# Altium project rovables_motor_driver_v3.PrjPcb
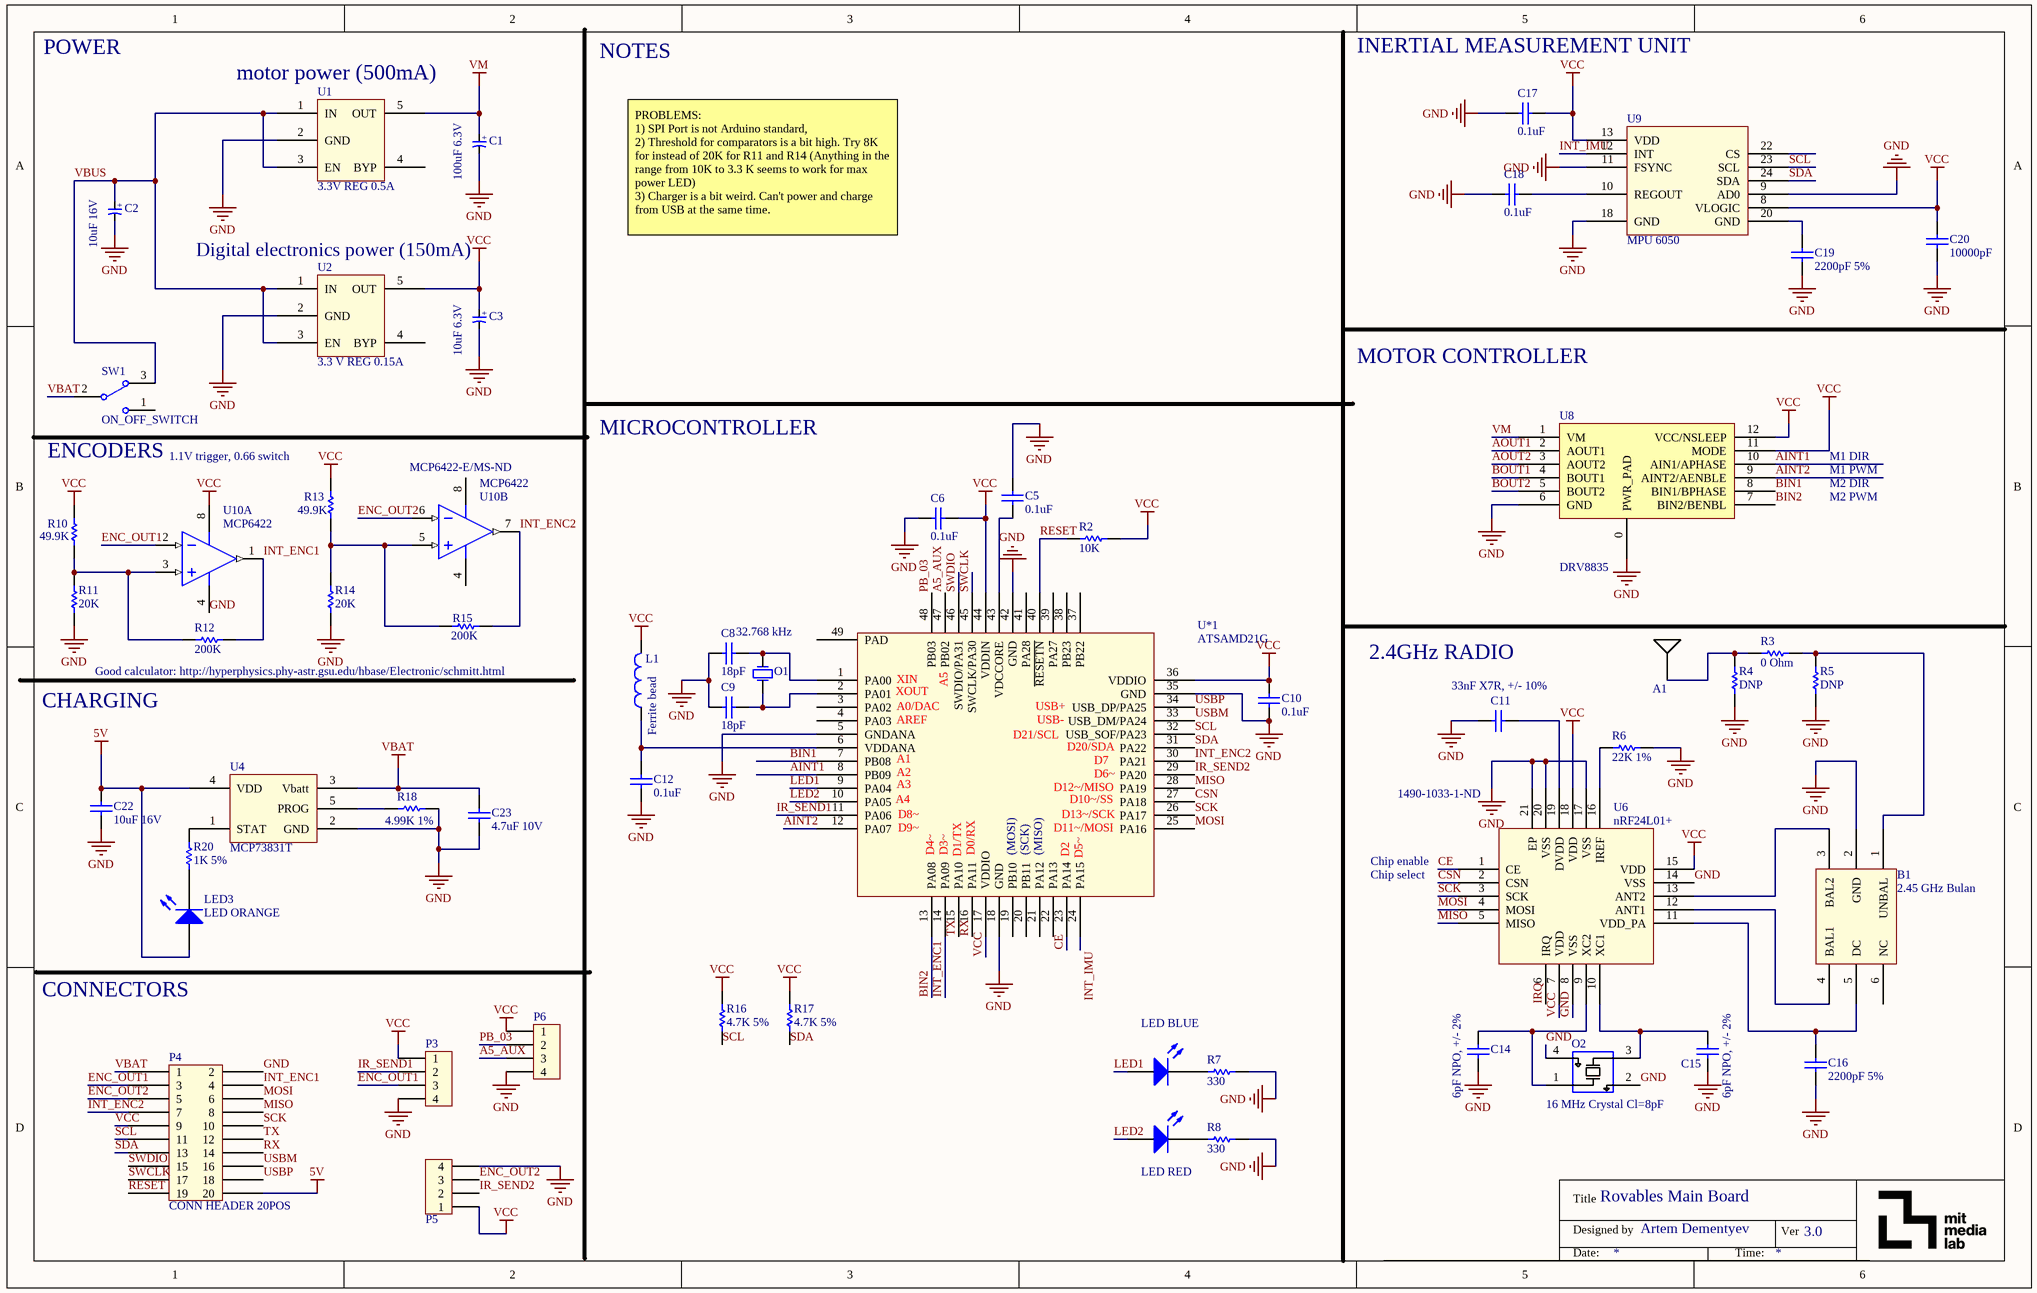
[diagram p0: schematic_motor_driver_v3.SchDoc]
1 sheet, 57 parts. Net scope: global (net labels, ports and power ports of the same name join across sheets).
Board file: PCB_motor_driver_v3.PcbDoc

## Sheet schematic_motor_driver_v3.SchDoc: Rovables Main Board
size B; Author: Artem Dementyev; Revision: 3.0; SheetNumber: 1; SheetTotal: 1

### Parts
A1  2.4GHz SMT On-ground MID Chip Antenna  [47948-0001]  (value not drawn)
B1  2.45 GHz Bulan  [2450BM14A0002]
C1  100uF 6.3V  [CAP1206]
C2  10uF 16V  [CAP0805]
C3  10uF 6.3V  [0805 TANTALUM]
C5  0.1uF  [0603W]
C6  0.1uF  [0402 CAPACITOR]
C8  18pF  [0402 CAPACITOR]
C9  18pF  [0402 CAPACITOR]
C10  0.1uF  [0402 CAPACITOR]
C11  33nF X7R, +/- 10%  [0402 CAPACITOR]
C12  0.1uF  [0603W]
C14  6pF NPO, +/- 2%  [0402 CAPACITOR]
C15  6pF NPO, +/- 2%  [0402 CAPACITOR]
C16  2200pF 5%  [0402 CAPACITOR]
C17  0.1uF  [0402 CAPACITOR]
C18  0.1uF  [0402 CAPACITOR]
C19  2200pF 5%  [0402 CAPACITOR]
C20  10000pF  [0402 CAPACITOR]
C22  10uF 16V  [0603W]
C23  4.7uF 10V  [0603W]
L1  Ferrite bead  [0603W]
LED1  LED BLUE  [0402W]
LED2  LED RED  [0402W]
LED3  LED ORANGE  [0402W]
O1  32.768 kHz  [32.768 Crystal]
O2  16 MHz Crystal Cl=8pF  [2.5 x 2.0 crystal]
P3  FH33J-4S-0.5SH(99)  [FH33J-4S-0.5SH(99)]  (value not drawn)
P4  CONN HEADER 20POS  [DF12 20 POS]
P5  FH33J-4S-0.5SH(99)  [FH33J-4S-0.5SH(99)]  (value not drawn)
P6  FH33J-4S-0.5SH(99)  [FH33J-4S-0.5SH(99)]  (value not drawn)
R2  10K  [0402 RESISTOR]
R3  0 Ohm  [0402 RESISTOR]
R4  DNP  [0402 RESISTOR]
R5  DNP  [0402 RESISTOR]
R6  22K 1%  [0402 RESISTOR]
R7  330  [0402 RESISTOR]
R8  330  [0402 RESISTOR]
R10  49.9K  [0603W]
R11  20K  [0603W]
R12  200K  [0603W]
R13  49.9K  [0603W]
R14  20K  [0603W]
R15  200K  [0603W]
R16  4.7K 5%  [0402 RESISTOR]
R17  4.7K 5%  [0402 RESISTOR]
R18  4.99K 1%  [0603W]
R20  1K 5%  [0603W]
SW1  ON_OFF_SWITCH  [SWTICH_SMD_SIDE]
U1  3.3V REG 0.5A  [SOT-23-5]
U2  3.3 V REG 0.15A  [SOT-23-5]
U4  MCP73831T  [SOT-23-5]
U6  nRF24L01+  Supplier Part Number 1: 1490-1033-1-ND  [QFN20]
U8  DRV8835  [WSON-16]
U9  MPU 6050  [QFN24]
U10  MCP6422  [MSOP-MS8_N]  (parts A,B of 2)
U*1  ATSAMD21G  [TQFN48]

### Nets
5V: C22.1 LED3.1(A) P4.20 U4.4(VDD)
GND: B1.2(GND) C1.2 C2.2 C3.2 C5.2 C6.2 C8.2 C9.2 C10.1 C11.2 C12.1 C14.1 C15.1 C16.1 C17.2 C18.2 C19.2 C20.2 C22.2 C23.2 O2.2(Gnd) O2.4(Gnd) P3.4 P4.2 P5.4 P6.4 R4.1 R5.1 R6.1 R7.1 R8.1 R11.1 R14.1 R18.1 U1.2(GND) U2.2(GND) U4.2(GND) U6.8(VSS) U6.14(VSS) U6.17(VSS) U6.20(VSS) U6.21(EP) U8.0(PWR_PAD) U8.6(GND) U9.9(AD0) U9.11(FSYNC) U9.18(GND) U10.4(VSS) U*1.5(GNDANA) U*1.18(GND) U*1.35(GND) U*1.42(GND)
VBAT: C23.1 P4.1 SW1.2 U4.3(Vbatt)
VCC: C3.1 C6.1 C10.2 C17.1 C20.1 L1.2 P3.1 P4.9 P5.1 P6.1 R2.1 R10.2 R13.2 R16.1 R17.1 U2.5(OUT) U6.7(VDD) U6.15(VDD) U6.18(VDD) U8.11(MODE) U8.12(VCC/NSLEEP) U9.8(VLOGIC) U9.13(VDD) U10.8(VDD) U*1.17(VDDIO) U*1.36(VDDIO) U*1.44(VDDIN)
VM: C1.1 U1.5(OUT) U8.1(VM)
A5_AUX: P6.3 U*1.47(PB02)
AINT1: U8.10(AIN1/APHASE) U*1.8(PB09)
AINT2: U8.9(AINT2/AENBLE) U*1.12(PA07)
AOUT1: U8.2(AOUT1)
AOUT2: U8.3(AOUT2)
BIN1: U8.8(BIN1/BPHASE) U*1.7(PB08)
BIN2: U8.7(BIN2/BENBL) U*1.13(PA08)
BOUT1: U8.4(BOUT1)
BOUT2: U8.5(BOUT2)
CE: U6.1(CE) U*1.23(PA14)
CSN: U6.2(CSN) U*1.27(PA18)
ENC_OUT1: P3.3 P4.3 U10.2(VINA-)
ENC_OUT2: P4.5 P5.3 U10.6(VINB-)
INT_ENC1: P4.4 R12.1 U10.1(VOUTA) U*1.14(PA09)
INT_ENC2: P4.7 R15.1 U10.7(VOUTB) U*1.30(PA21)
INT_IMU: U9.12(INT) U*1.24(PA15)
IR_SEND1: P3.2 U*1.11(PA06)
IR_SEND2: P5.2 U*1.29(PA20)
IRQ: U6.6(IRQ)
LED1: LED1.1(A) U*1.9(PA04)
LED2: LED2.1(A) U*1.10(PA05)
MISO: P4.8 U6.5(MISO) U*1.28(PA19)
MOSI: P4.6 U6.4(MOSI) U*1.25(PA16)
PB_03: P6.2 U*1.48(PB03)
RESET: P4.19 R2.2 U*1.40(~{RESETN})
RX: P4.14 U*1.16(PA11)
SCK: P4.10 U6.3(SCK) U*1.26(PA17)
SCL: P4.11 R16.2 U9.23(SCL) U*1.32(USB_SOF/PA23)
SDA: P4.13 R17.2 U9.24(SDA) U*1.31(PA22)
SWCLK: P4.17 U*1.45(SWCLK/PA30)
SWDIO: P4.15 U*1.46(SWDIO/PA31)
TX: P4.12 U*1.15(PA10)
USBM: P4.16 U*1.33(USB_DM/PA24)
USBP: P4.18 U*1.34(USB_DP/PA25)
VBUS: C2.1 SW1.3 U1.1(IN) U1.3(EN) U2.1(IN) U2.3(EN)
NetA1_1: A1.1 R3.1 R4.2
NetB1_1: B1.1(UNBAL) R3.2 R5.2
NetB1_3: B1.3(BAL2) U6.13(ANT2)
NetB1_4: B1.4(BAL1) U6.12(ANT1)
NetB1_5: B1.5(DC) C16.2 U6.11(VDD_PA)
NetC5_1: C5.1 U*1.43(VDCCORE)
NetC8_1: C8.1 O1.1 U*1.1(PA00)
NetC9_1: C9.1 O1.2 U*1.2(PA01)
NetC11_1: C11.1 U6.19(DVDD)
NetC12_2: C12.2 L1.1 U*1.6(VDDANA)
NetC14_2: C14.2 O2.1(XIN) U6.9(XC2)
NetC15_2: C15.2 O2.3(XOUT) U6.10(XC1)
NetC18_1: C18.1 U9.10(REGOUT)
NetC19_1: C19.1 U9.20(GND)
NetLED1_2: LED1.2(K) R7.2
NetLED2_2: LED2.2(K) R8.2
NetLED3_2: LED3.2(K) R20.1
NetR6_2: R6.2 U6.16(IREF)
NetR10_1: R10.1 R11.2 R12.2 U10.3(VINA+)
NetR13_1: R13.1 R14.2 R15.2 U10.5(VINB+)
NetR18_2: R18.2 U4.5(PROG)
NetR20_2: R20.2 U4.1(STAT)

Not connected (* = marked no-connect by the designer): B1 6(NC); SW1 1; U1 4(BYP); U2 4(BYP); U9 22(CS); U*1 3(PA02) 4(PA03) 19(PB10) 20(PB11) 21(PA12) 22(PA13) 37(PB22) 38(PB23) 39(PA27) 41(PA28) 49(PAD)

### Notes on the sheet
- POWER
- (near U1) motor power (500mA)
- NOTES
- INERTIAL MEASUREMENT UNIT
- PROBLEMS:
  1) SPI Port is not Arduino standard,
  2) Threshold for comparators is a bit high. Try 8K for instead of 20K for R11 and R14 (Anything in the range from 10K to 3.3 K seems to work for max power LED)
  3) Charger is a bit weird. Can't power and charge from USB at the same time.
- (near U2) Digital electronics power (150mA)
- MOTOR CONTROLLER
- MICROCONTROLLER
- (near SW1) ENCODERS
- (near R13) 1.1V trigger, 0.66 switch
- M2 PWM
- M2 DIR
- M1 PWM
- M1 DIR
- Good calculator: http://hyperphysics.phy-astr.gsu.edu/hbase/Electronic/schmitt.html
- 2.4GHz RADIO
- CHARGING
- (near U*1) (MOSI)
- (near U*1) (SCK)
- (near U*1) (MISO)
- Chip enable
- Chip select
- CONNECTORS
- Title
- Designed by
- Ver
- Date:
- Time:
- (in symbol ATSAMD21G) XIN; A5; XOUT; A0/DAC; USB+; AREF; USB-; D21/SCL; D20/SDA; A1; D7; A2; D6~; A3; D12~/MISO; A4; D10~/SS; D8~; D13~/SCK; D9~; D11~/MOSI; D4~; D3~; D1/TX; D0/RX; D2; D5~
- (in symbol Capacitor_pol) +

### Library data of the parts
A1 = 2.4GHz SMT On-ground MID Chip Antenna: Bluetooth antenna; manufacturer: Molex; digikey part number: WM4893CT-ND; manufacturer part number: 47948-0001; Supplier 1: Digi-Key; Supplier Part Number 1: WM4893CT-ND
B1 = 2.45 GHz Bulan: for nRF8001 chip; digikey number: 712-1574-1-ND; Supplier 1: Digi-Key; Supplier Part Number 1: 712-1574-1-ND
C1-C3 = Capacitor_pol: Polarised capacitor
  C1: digikey part number 1206: 718-1920-1-ND; digikey part numbe 0805: 478-6613-2-ND; Supplier 1: Digikey; Supplier Part Number 1: 718-1920-1-ND
  C2: digikey part number: 478-8654-1-ND; Supplier 1: Digi-Key; Supplier Part Number 1: 478-8654-1-ND
  C3: digikey part number: 478-9265-1-ND; Supplier 1: Digi-Key; Supplier Part Number 1: 478-9265-1-ND
C5 C6 C8-C12 C14-C20 C22 C23 = Capacitor: SMD Cap 1206
  C5: Supplier 1: Digikey; Supplier Part Number 1: 311-1343-1-ND
  C6 C10: Supplier 1: Digikey; Supplier Part Number 1: 1276-1443-6-ND
  C8 C9: Supplier 1: Digikey; Supplier Part Number 1: 490-5858-1-ND
  C11: digikey number: 490-1532-1-ND; Supplier 1: Digikey; Supplier Part Number 1: 399-4891-1-ND
  C14 C15: digikey number: 490-8223-1-ND; Supplier 1: Digikey; Supplier Part Number 1: 490-8223-6-ND
  C16: digikey number: 399-8957-1-ND; Supplier 1: Digikey; Supplier Part Number 1: 399-8957-1-ND
  C17 C18: digikey number: 587-3383-1-ND; Supplier 1: Digikey; Supplier Part Number 1: 1276-1443-6-ND
  C19: digikey number: 587-3383-1-ND; Supplier 1: Digikey; Supplier Part Number 1: 399-8957-1-ND
  C20: digikey number: 587-3383-1-ND; Supplier 1: Digikey; Supplier Part Number 1: 490-4516-1-ND
  C22: Supplier 1: Digikey; Supplier Part Number 1: 490-3298-1-ND; Supplier 2: Mouser; Supplier Part Number 2: 81-GRM188C81C106MA3D
  C23: Supplier 1: Digikey; Supplier Part Number 1: 490-10477-1-ND
L1 = INDUCTOR Low DCR: Digikey: 490-5223-2-ND; Supplier 1: Digikey; Supplier Part Number 1: 490-5223-2-ND
LED1-LED3 = LED: LED SMD 1206/0603; Supplier 1: Digikey
  LED1: Supplier Part Number 1: LNJ947W8CRACT-ND
  LED2: Supplier Part Number 1: LNJ247W82RACT-ND
  LED3: Supplier Part Number 1: LNJ437W84RACT-ND
O1 = 32.768 Crystal: digikey number: XC1617CT-ND; Supplier 1: Digi-Key; Supplier Part Number 1: XC1617CT-ND
O2 = 16 MHz Crystal Wireless: For BLE use; digikey number: 644-1169-1-ND; Supplier 1: Digi-Key; Supplier Part Number 1: 644-1169-1-ND
P3 P5 P6 = FH33J-4S-0.5SH(99): 0.5mm FPC connector; digikey part number: H124646CT-ND; Supplier 1: Digi-Key; Supplier Part Number 1: H124646CT-ND
P4 = CONN HEADER 20POS: manufacturer part number: DF12D(4.0)-20DP-0.5V(81); manufacturer: Hirose Electric Co Ltd; System: Connector; digikey part number: H11743CT-ND; Supplier 1: Digi-Key; Supplier Part Number 1: H11743CT-ND
R2-R8 R10-R18 R20 = Resistor: Supplier 1: Digikey
  R2: Supplier Part Number 1: 311-10KJRCT-ND
  R3-R5: digikey number: RMCF0603FT10K0CT-ND; Supplier Part Number 1: 311-0.0GRCT-ND
  R6: digikey number: P20.0KLCT-ND; Supplier Part Number 1: 311-22.0KLRCT-ND
  R7 R8: digikey number: RMCF0603FT10K0CT-ND; Supplier Part Number 1: 311-330JRCT-ND
  R10 R13: digikey part number: *; manufacturer: *; manufacturer part number: *; Supplier Part Number 1: 311-49.9KHRCT-ND
  R11 R14: digikey part number: *; manufacturer: *; manufacturer part number: *; Supplier Part Number 1: 311-20.0KHRCT-ND
  R12 R15: digikey part number: *; manufacturer: *; manufacturer part number: *; Supplier Part Number 1: 311-200KHRCT-ND
  R16 R17: digikey number: RMCF0603FT10K0CT-ND; Supplier Part Number 1: 311-4.7KJRCT-ND
  R18: digikey part number: *; manufacturer: *; manufacturer part number: *; Supplier Part Number 1: P4.99KHCT-ND
  R20: Supplier Part Number 1: 311-10KGRCT-ND
SW1 = ON_OFF_SWITCH: SPDT SMD Side Switch; Sparkfun#: COM-00597; digikey number: 563-1102-1-ND; Supplier 1: Digi-Key; Supplier Part Number 1: 563-1102-1-ND
U1 U2 = MIC5205_VOLTAGE_REG: 5V LDO SMD
  U1: Supplier 1: Digikey; Supplier Part Number 1: 576-1281-1-ND
  U2: Sparkfun #: PRT-1125; digikey number: 576-1259-1-ND; Supplier 1: Digi-Key; Supplier Part Number 1: 576-1259-1-ND; Supplier 2: Digikey; Supplier Part Number 2: 576-1259-1-ND
U4 = MCP73831T: manufacturer part number: MCP73831T-2ACI/OT; manufacturer: Microchip; digikey part number: MCP73831T-2ACI/OTTR-ND; Supplier 1: Digi-Key; Supplier Part Number 1: MCP73831T-2ACI/OTCT-ND
U6 = nRF24L01+: 2.4 GHz Radio; manufacturer part number: nRF24L01P-R; digikey part number: 1490-1033-1-ND; Supplier 1: Digi-Key
U8 = DRV8835: manufacturer: Texas Instruments; manufacturer part number: DRV8835DSSR; digikey part number: 296-30391-1-ND; Supplier 1: Digi-Key; Supplier Part Number 1: 296-30391-1-ND
U9 = MPU_6500: Gyro / accelerometer combo; Supplier 1: Digi-Key; Supplier Part Number 1: 1428-1007-1-ND
U10 = MCP6422: 4.4 µA/Amplifier, 90 kHz Op Amp; manufacturer: Microchip Technology; manufacturer part number: MCP6422-E/MS; digikey part number: MCP6422-E/MS-ND
U*1 = ATSAMD21G: IC MCU 32BIT 256KB FLASH 48TQFP; digikey part number: ATSAMD21G18A-AUTCT-ND; Supplier 1: Digi-Key; Supplier Part Number 1: ATSAMD21G18A-AUTCT-ND